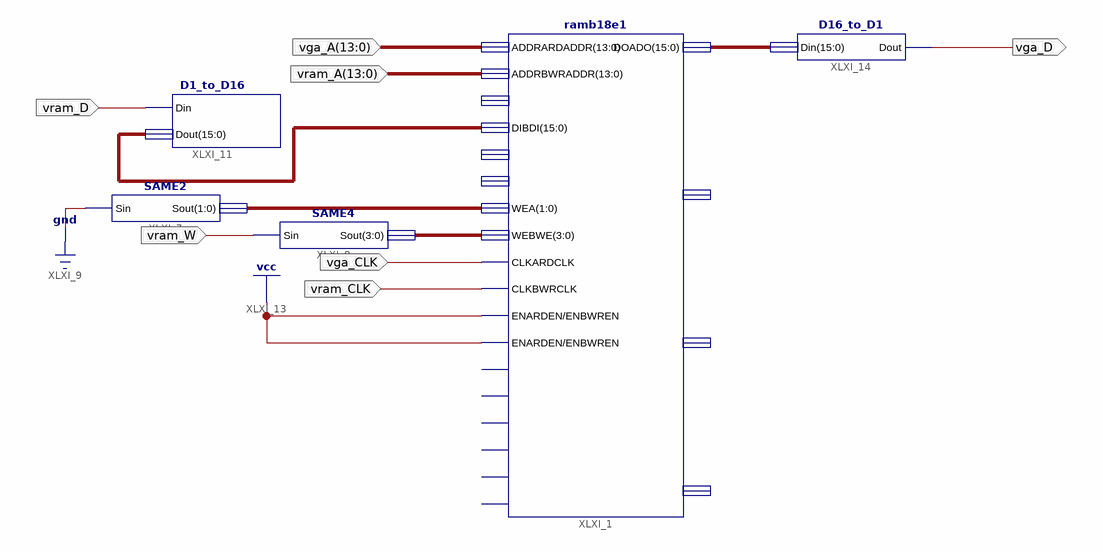
[diagram p0: schematic sheet 1]
// Xilinx ISE schematic VRAM_Amstrad_NEXYS4.sch (artix7) as structural Verilog: 5 symbols, 7 ports
module VRAM_Amstrad_NEXYS4 (
  input  [13:0] vga_A,
  input  [13:0] vram_A,
  input  vga_CLK,
  input  vram_CLK,
  input  vram_W,
  input  vram_D,
  output vga_D
);

  wire [1:0] XLXN_15;
  wire [3:0] XLXN_16;
  wire [15:0] XLXN_1, XLXN_3;

  SAME2 XLXI_7 (.Sin(1'b0), .Sout(XLXN_15));
  SAME4 XLXI_8 (.Sin(vram_W), .Sout(XLXN_16));
  D16_to_D1 XLXI_14 (.Din(XLXN_3), .Dout(vga_D));
  D1_to_D16 XLXI_11 (.Din(vram_D), .Dout(XLXN_1));
  ramb18e1 #(.RAM_MODE("TDP"), .WRITE_WIDTH_A(1), .READ_WIDTH_B(1), .SIM_DEVICE("7SERIES"), .WRITE_MODE_B("WRITE_FIRST"), .RDADDR_COLLISION_HWCONFIG("PERFORMANCE"), .WRITE_WIDTH_B(1), .WRITE_MODE_A("READ_FIRST"), .READ_WIDTH_A(1)) XLXI_1 (
    .ADDRARDADDR(vga_A), .ADDRBWRADDR(vram_A), .DIBDI(XLXN_1), .WEA(XLXN_15), .WEBWE(XLXN_16),
    .CLKARDCLK(vga_CLK), .CLKBWRCLK(vram_CLK), .ENARDEN(1'b1), .ENBWREN(1'b1), .DOADO(XLXN_3));  // open: DIADI, DIPADIP, DIPBDIP, REGCEAREGCE, REGCEB, RSTRAMARSTRAM, RSTRAMB, RSTREGARSTREG, RSTREGB, DOBDO, DOPADOP, DOPBDOP
endmodule
